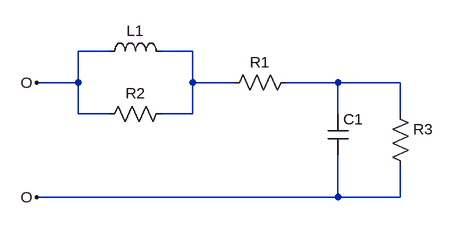
[diagram p0: schematic Circuito.asc]
Circuito.asc, the LTspice schematic file:
Version 4
SHEET 1 880 680
WIRE 64 96 16 96
WIRE 192 96 144 96
WIRE 16 144 16 96
WIRE 16 144 -48 144
WIRE 192 144 192 96
WIRE 256 144 192 144
WIRE 416 144 336 144
WIRE 512 144 416 144
WIRE 16 192 16 144
WIRE 64 192 16 192
WIRE 192 192 192 144
WIRE 192 192 144 192
WIRE 416 192 416 144
WIRE 512 192 512 144
WIRE 416 320 416 256
WIRE 416 320 -48 320
WIRE 512 320 512 272
WIRE 512 320 416 320
FLAG -48 144 O
FLAG -48 320 O
SYMBOL res 352 128 R90
WINDOW 0 0 56 VBottom 2
WINDOW 3 32 56 VTop 2
SYMATTR InstName R1
SYMATTR Value ""
SYMBOL res 160 176 R90
WINDOW 0 0 56 VBottom 2
WINDOW 3 32 56 VTop 2
SYMATTR InstName R2
SYMATTR Value ""
SYMBOL ind 48 112 R270
WINDOW 0 32 56 VTop 2
WINDOW 3 5 56 VBottom 2
SYMATTR InstName L1
SYMATTR Value ""
SYMBOL cap 400 192 R0
SYMATTR InstName C1
SYMATTR Value ""
SYMBOL res 496 176 R0
SYMATTR InstName R3
SYMATTR Value ""

The netlist it stands for:
* Circuito.asc
R1 N002 N001
R2 N001 O
L1 O N001
C1 N002 O
R3 N002 O
.backanno
.end